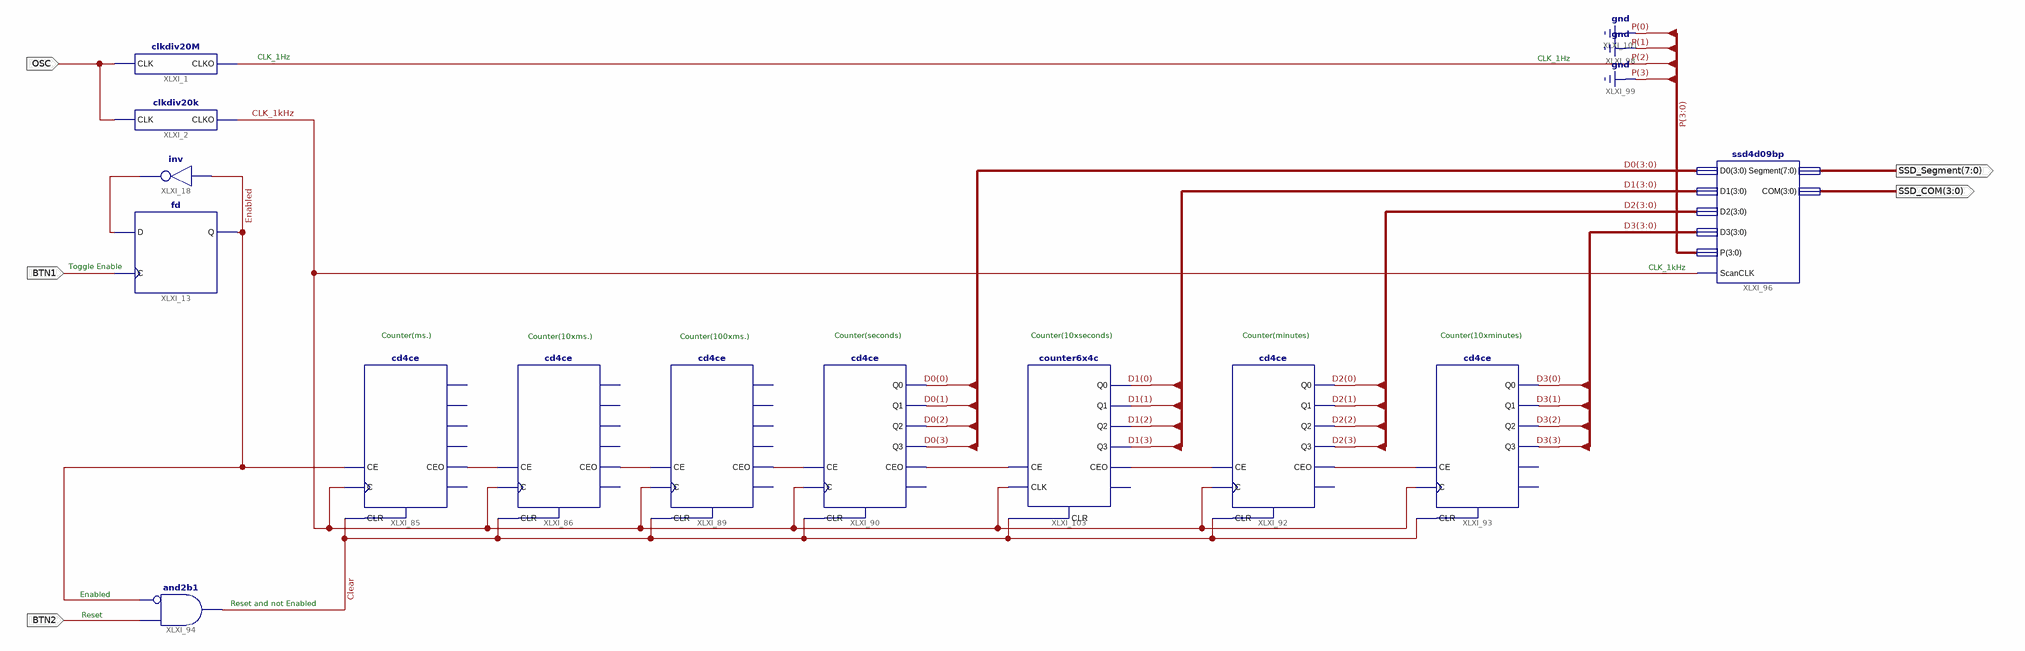
[diagram p0: schematic sheet 1]
// Xilinx ISE schematic main.sch (spartan6) as structural Verilog: 13 symbols, 5 ports
module main (
  input  OSC,
  input  BTN1,
  input  BTN2,
  output [3:0] SSD_COM,
  output [7:0] SSD_Segment
);

  wire Clear, CLK_1kHz, Enabled, XLXN_8, XLXN_242, XLXN_243, XLXN_244, XLXN_245, XLXN_246, XLXN_247;
  wire [3:0] D0, D1, D2, D3, P;

  clkdiv20M XLXI_1 (.CLK(OSC), .CLKO(P[2]));
  clkdiv20k XLXI_2 (.CLK(OSC), .CLKO(CLK_1kHz));
  fd XLXI_13 (.C(BTN1), .D(XLXN_8), .Q(Enabled));
  not XLXI_18 (XLXN_8, Enabled);
  cd4ce XLXI_85 (.C(CLK_1kHz), .CE(Enabled), .CLR(Clear), .CEO(XLXN_242));  // open: Q0, Q1, Q2, Q3, TC
  cd4ce XLXI_86 (.C(CLK_1kHz), .CE(XLXN_242), .CLR(Clear), .CEO(XLXN_243));  // open: Q0, Q1, Q2, Q3, TC
  cd4ce XLXI_89 (.C(CLK_1kHz), .CE(XLXN_243), .CLR(Clear), .CEO(XLXN_244));  // open: Q0, Q1, Q2, Q3, TC
  cd4ce XLXI_90 (
    .C(CLK_1kHz), .CE(XLXN_244), .CLR(Clear), .CEO(XLXN_245), .Q0(D0[0]), .Q1(D0[1]), .Q2(D0[2]), .Q3(D0[3]));  // open: TC
  cd4ce XLXI_92 (
    .C(CLK_1kHz), .CE(XLXN_246), .CLR(Clear), .CEO(XLXN_247), .Q0(D2[0]), .Q1(D2[1]), .Q2(D2[2]), .Q3(D2[3]));  // open: TC
  cd4ce XLXI_93 (
    .C(CLK_1kHz), .CE(XLXN_247), .CLR(Clear), .Q0(D3[0]), .Q1(D3[1]), .Q2(D3[2]), .Q3(D3[3]));  // open: CEO, TC
  and XLXI_94 (Clear, ~Enabled, BTN2);  // and2b1
  ssd4d09bp XLXI_96 (
    .COM(SSD_COM), .D0(D0), .D1(D1), .D2(D2), .D3(D3), .P(P), .ScanCLK(CLK_1kHz), .Segment(SSD_Segment));
  counter6x4c XLXI_103 (
    .CEO(XLXN_246), .Q0(D1[0]), .Q1(D1[1]), .Q2(D1[2]), .Q3(D1[3]), .CE(XLXN_245), .CLK(CLK_1kHz), .CLR(Clear));  // open: TC
  // also tied to GND on the sheet: {P[0], P[1], P[3]}

  // Notes on the sheet:
  //   CLK_1Hz
  //   CLK_1Hz
  //   Toggle Enable
  //   CLK_1kHz
  //   Counter(ms.)
  //   Counter(seconds)
  //   Counter(10xseconds)
  //   Counter(minutes)
  //   Counter(10xminutes)
  //   Counter(10xms.)
  //   Counter(100xms.)
  //   Enabled
  //   Reset and not Enabled
  //   Reset
endmodule
